# Altium schematic sheet Khoi_Output.SchDoc
size A4; SheetNumber: 4; SheetTotal: 6
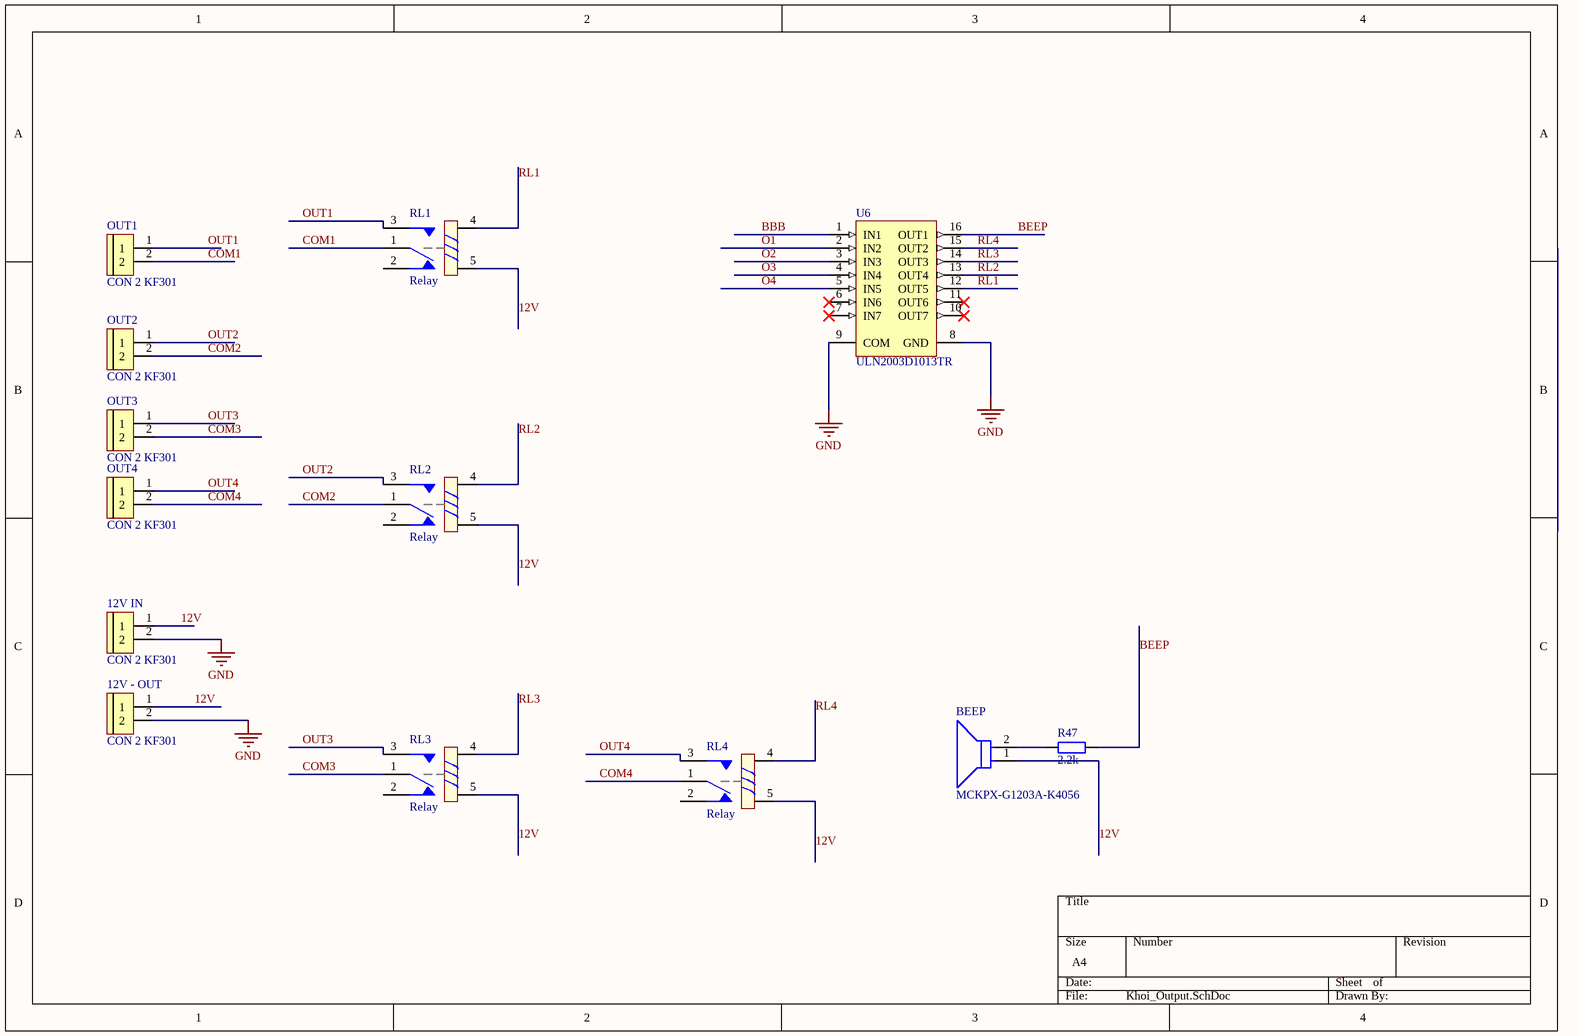
[diagram p0: Khoi_Output.SchDoc]

## Parts
12V_-_OUT  CON 2 KF301  [Con 2 KF301 5.08]
12V_IN  CON 2 KF301  [Con 2 KF301 5.08]
BEEP  MCKPX-G1203A-K4056  [FP-MCKPX-G1203A-K4056-MFG]
OUT1  CON 2 KF301  [Con 2 KF301 5.08]
OUT2  CON 2 KF301  [Con 2 KF301 5.08]
OUT3  CON 2 KF301  [Con 2 KF301 5.08]
OUT4  CON 2 KF301  [Con 2 KF301 5.08]
R47  2.2k  [tro smd 0805]
RL1  Relay  [RL_SPDT_10A]
RL2  Relay  [RL_SPDT_10A]
RL3  Relay  [RL_SPDT_10A]
RL4  Relay  [RL_SPDT_10A]
U6  ULN2003D1013TR  [STM-SO-16_M]

## Nets
GND: 12V_-_OUT.2 12V_IN.2 U6.8(GND) U6.9(COM)
12V: 12V_-_OUT.1 12V_IN.1 BEEP.1(C) RL1.5 RL2.5 RL3.5 RL4.5
BBB: U6.1(IN1)
BEEP: R47.1 U6.16(OUT1)
COM1: OUT1.2 RL1.1
COM2: OUT2.2 RL2.1
COM3: OUT3.2 RL3.1
COM4: OUT4.2 RL4.1
O1: U6.2(IN2)
O2: U6.3(IN3)
O3: U6.4(IN4)
O4: U6.5(IN5)
OUT1: OUT1.1 RL1.3
OUT2: OUT2.1 RL2.3
OUT3: OUT3.1 RL3.3
OUT4: OUT4.1 RL4.3
RL1: RL1.4 U6.12(OUT5)
RL2: RL2.4 U6.13(OUT4)
RL3: RL3.4 U6.14(OUT3)
RL4: RL4.4 U6.15(OUT2)
NetBEEP_2: BEEP.2(A) R47.2

Not connected (* = marked no-connect by the designer): RL1 2; RL2 2; RL3 2; RL4 2; U6 6(IN6)* 7(IN7)* 10(OUT7)* 11(OUT6)*

## Library data of the parts
12V_-_OUT 12V_IN OUT1-OUT4 = CON 2 KF301: Cắm; Ma_Hang: MH000987; Ten_Linh_Kien: CON 2 KF301-2P 5.08MM Xanh Dương; Chung_Loai: Cắm; Ghi_Chu: *; Kieu_Chan: *; Don_Vi: Con
BEEP = CMP-12433-000001-1: MAGNETIC BUZZER AND TRANSDUCER - More Details; Manufacturer: Multicomp Pro; Operating Supply Voltage: 3V; Current: 30mA; Frequency: 2300Hz; Max Supply Voltage: 5V; Min Supply Voltage: 2V; Standoff Height: 0.5mm; ComponentLink2Description: Datasheet; ComponentLink2URL: http://www.farnell.com/datasheets/1498149.pdf?_ga=2.17855225.1157923166.1572356775-536200964.1569240579; Manufacturer Part Number: MCKPX-G1203A-K4056; Temperature Range High: +70°C; Device Class L2: Audio Products; Temperature Range Low: -20°C; Package: 0; Temperature: -20°C to +70°C; Category: Speak; Octopart: https://octopart.com/mckpx-g1203a-k4056-multicomp-12157154; RoHS: TRUE; Lead Free: Yes; Height: 9.5mm; Device Class L1: Electromechanical; Automotive: No; Device Class L3: Buzzers
R47 = Tro 0805 1% 2k: Dán; Don_Vi: Con; So_Chan: 2; Ten_Linh_Kien: Trở 0805 1% 2k; Ma_Hang: MH005471; Chung_Loai: Dán; Kieu_Chan: *
RL1-RL4 = Relay 1: Relay SPDT 5 Pin; Value: Relay SPDT, 10A, 12V
U6 = CMP-2000-05374-1: Seven NPN Darlington Array Transistor, 50 V, 500 mA, -40 to 85 degC, 8-Pin SOIC, RoHS, Tape and Reel; Manufacturer: STMicroelectronics; Collector Emitter Voltage V(br)ceo: 50V; SVHC: NoSVHC(17-Dec-2015); DC Current Gain hFE: 1000hFE; DC Collector Current: 500mA; No. of Pins: 16Pins; Package Reference: SO-16; Transistor Polarity: NPN; Transistor Case Style: SOIC; Datasheet URL: https://datasheet.ciiva.com/1193/1690348-1193460.pdf; Package Description: 16-Pin Small Outline Integrated Circuit, Body 9.9 x 3.9 mm, Pitch 1.27 mm; Datasheet Version: Rev. 8, 06/2012; Power Dissipation Pd: -; Product Range: -; Operating Temperature Max: 85degC; MSL: MSL1-Unlimited; Manufacturer URL: http://www.st.com/; Automotive Qualification Standard: -